# EAGLE design B165A (EAGLE 6.6.0)
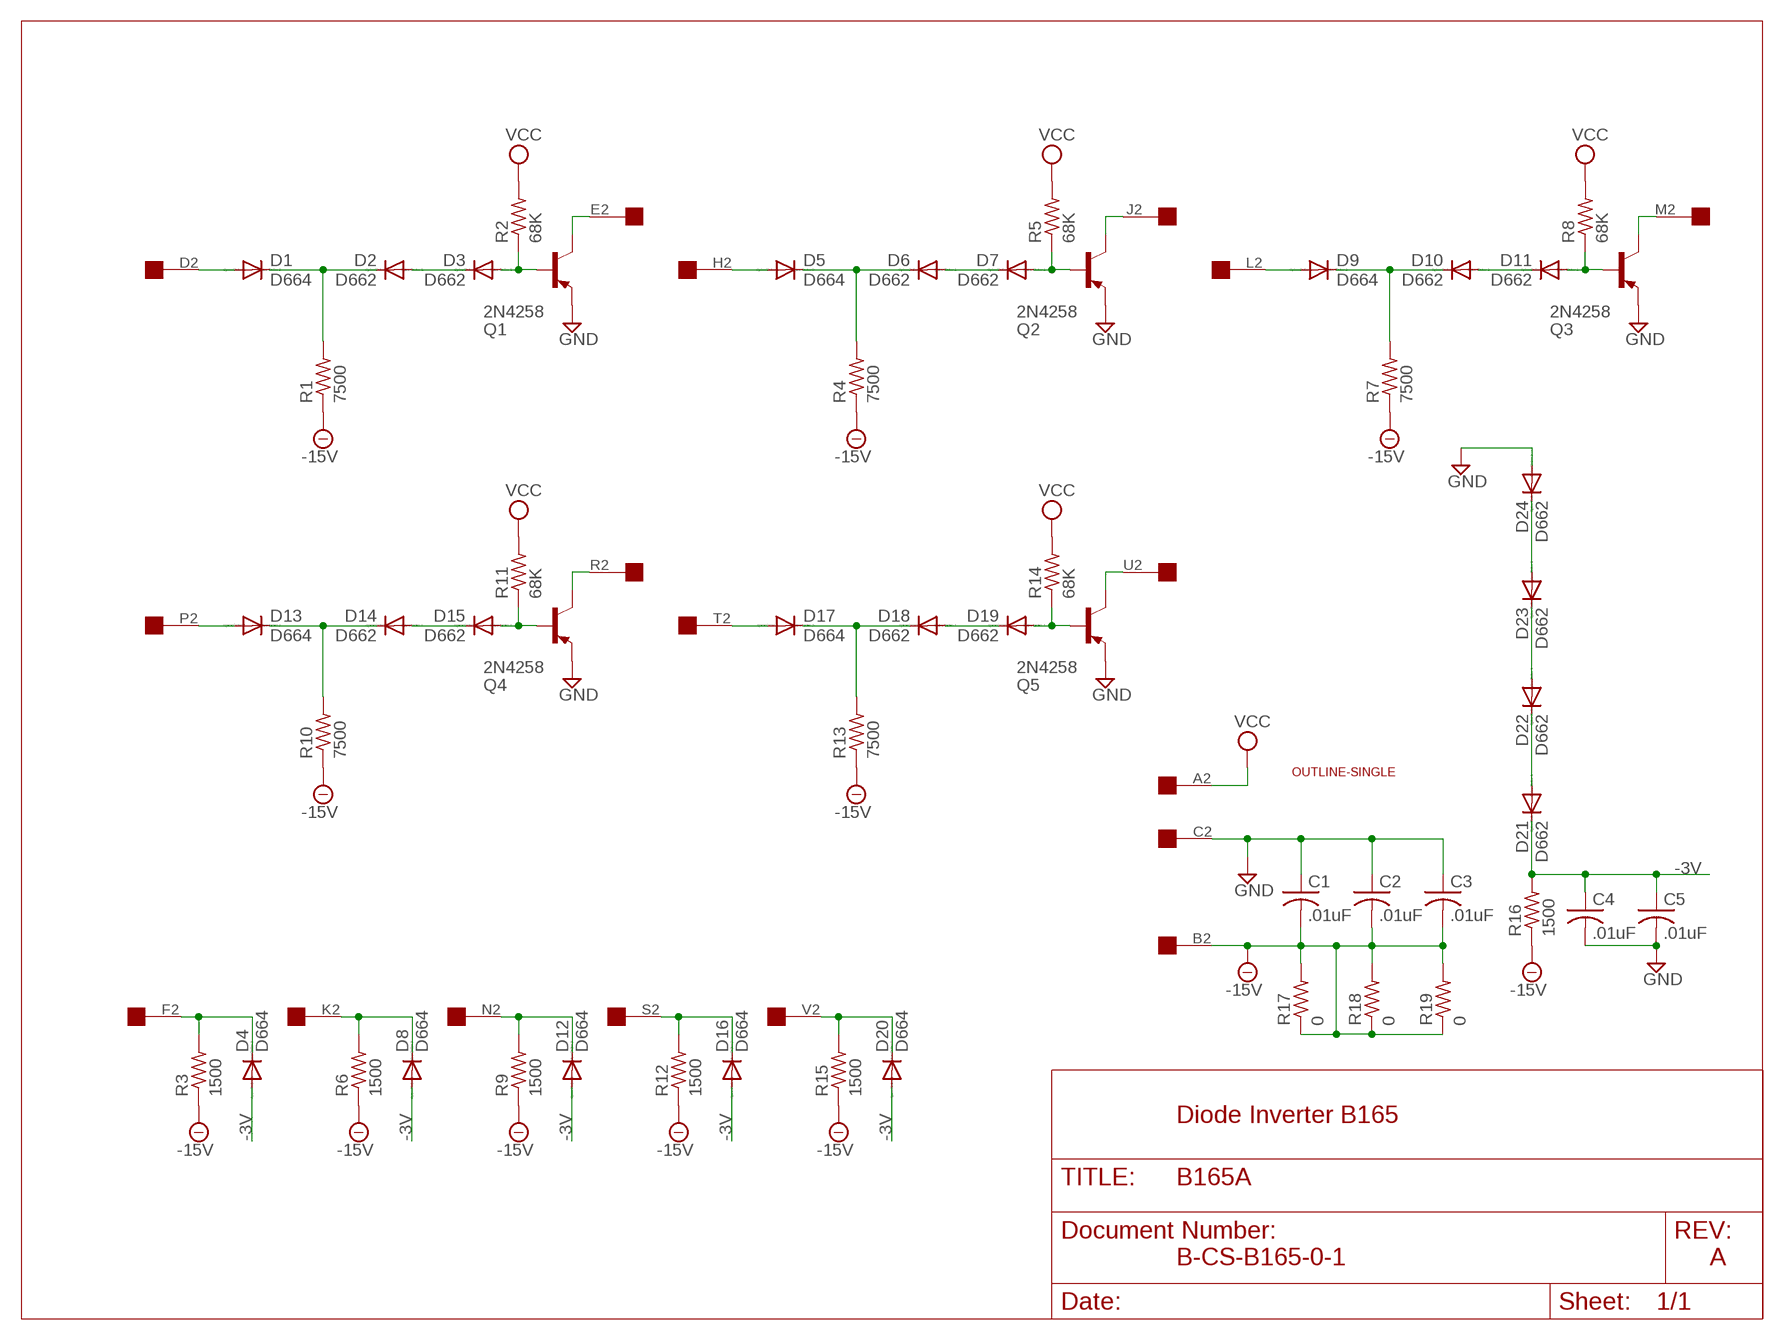
[diagram p0: schematic, sheet 1]

## Parts
C1  .01uF  C-US  [C063-025X075]
C2  .01uF  C-US  [C063-025X075]
C3  .01uF  C-US  [C063-025X075]
C4  .01uF  C-US  [C063-025X075]
C5  .01uF  C-US  [C063-025X075]
D1  D664  DIODE-DO35-10  [DO35-10]
D2  D662  DIODE-DO35-10  [DO35-10]
D3  D662  DIODE-DO35-10  [DO35-10]
D4  D664  DIODE-DO35-10  [DO35-10]
D5  D664  DIODE-DO35-10  [DO35-10]
D6  D662  DIODE-DO35-10  [DO35-10]
D7  D662  DIODE-DO35-10  [DO35-10]
D8  D664  DIODE-DO35-10  [DO35-10]
D9  D664  DIODE-DO35-10  [DO35-10]
D10  D662  DIODE-DO35-10  [DO35-10]
D11  D662  DIODE-DO35-10  [DO35-10]
D12  D664  DIODE-DO35-10  [DO35-10]
D13  D664  DIODE-DO35-10  [DO35-10]
D14  D662  DIODE-DO35-10  [DO35-10]
D15  D662  DIODE-DO35-10  [DO35-10]
D16  D664  DIODE-DO35-10  [DO35-10]
D17  D664  DIODE-DO35-10  [DO35-10]
D18  D662  DIODE-DO35-10  [DO35-10]
D19  D662  DIODE-DO35-10  [DO35-10]
D20  D664  DIODE-DO35-10  [DO35-10]
D21  D662  DIODE-DO35-10  [DO35-10]
D22  D662  DIODE-DO35-10  [DO35-10]
D23  D662  DIODE-DO35-10  [DO35-10]
D24  D662  DIODE-DO35-10  [DO35-10]
Q1  2N4258  -PNP-TO5  [TO5]
Q2  2N4258  -PNP-TO5  [TO5]
Q3  2N4258  -PNP-TO5  [TO5]
Q4  2N4258  -PNP-TO5  [TO5]
Q5  2N4258  -PNP-TO5  [TO5]
R1  7500  R-US_0207/10  [0207/10]
R2  68K  R-US_0207/10  [0207/10]
R3  1500  R-US_0207/10  [0207/10]
R4  7500  R-US_0207/10  [0207/10]
R5  68K  R-US_0207/10  [0207/10]
R6  1500  R-US_0207/10  [0207/10]
R7  7500  R-US_0207/10  [0207/10]
R8  68K  R-US_0207/10  [0207/10]
R9  1500  R-US_0207/10  [0207/10]
R10  7500  R-US_0207/10  [0207/10]
R11  68K  R-US_0207/10  [0207/10]
R12  1500  R-US_0207/10  [0207/10]
R13  7500  R-US_0207/10  [0207/10]
R14  68K  R-US_0207/10  [0207/10]
R15  1500  R-US_0207/10  [0207/10]
R16  1500  R-US_0207/10  [0207/10]
R17  0  R-US_0207/10  [0207/10]
R18  0  R-US_0207/10  [0207/10]
R19  0  R-US_0207/10  [0207/10]
U$1  OUTLINE-SINGLE  [SINGLE]
U$2  EDGE-1  [EDGE-CON1]

## Nets
-3V: C4.1 C5.1 D4.A D8.A D12.A D16.A D20.A D21.C R16.2
-15V: C1.2 C2.2 C3.2 R1.1 R3.1 R4.1 R6.1 R7.1 R9.1 R10.1 R12.1 R13.1 R15.1 R16.1 R17.1 R17.2 R18.1 R18.2 R19.1 R19.2 U$2.B2
GND: C1.1 C2.1 C3.1 C4.2 C5.2 D24.A Q1.1(E) Q2.1(E) Q3.1(E) Q4.1(E) Q5.1(E) U$2.C2
N$1: D1.A U$2.D2
N$2: D1.C D2.C R1.2
N$3: D2.A D3.C
N$4: D16.C R12.2 U$2.S2
N$5: D3.A Q1.2(B) R2.1
N$6: Q1.3(C) U$2.E2
N$7: D4.C R3.2 U$2.F2
N$8: D8.C R6.2 U$2.K2
N$9: D12.C R9.2 U$2.N2
N$10: D5.A U$2.H2
N$11: D5.C D6.C R4.2
N$12: D6.A D7.C
N$13: D17.A U$2.T2
N$14: D7.A Q2.2(B) R5.1
N$15: Q2.3(C) U$2.J2
N$16: D9.A U$2.L2
N$17: D9.C D10.C R7.2
N$18: D10.A D11.C
N$19: D17.C D18.C R13.2
N$20: D11.A Q3.2(B) R8.1
N$21: Q3.3(C) U$2.M2
N$22: D13.A U$2.P2
N$23: D13.C D14.C R10.2
N$24: D14.A D15.C
N$25: D18.A D19.C
N$26: D15.A Q4.2(B) R11.1
N$27: Q4.3(C) U$2.R2
N$28: D23.A D24.C
N$29: D22.A D23.C
N$30: D19.A Q5.2(B) R14.1
N$31: D21.A D22.C
N$32: Q5.3(C) U$2.U2
N$33: D20.C R15.2 U$2.V2
VCC: R2.2 R5.2 R8.2 R11.2 R14.2 U$2.A2

## Notes on the sheet
- Diode Inverter B165
- B-CS-B165-0-1 | A

## Library data of the parts
C1-C5 = dec-con:C-US: Capacitors with funky DEC lead spacing.
D1-D24 = diode:DIODE-: DIODE
Q1-Q5 = transistor:*-PNP-: PNP Transistror
R1-R19 = rcl:R-US_: RESISTOR, American symbol
U$1 = dec-con:OUTLINE-*: Board outlines for DEC boards.
U$2 = dec-con:EDGE-1: Single-Sided DEC Edge Connector -- (side 2)

## Net classes
0 default: width 0.813 mm

## Board
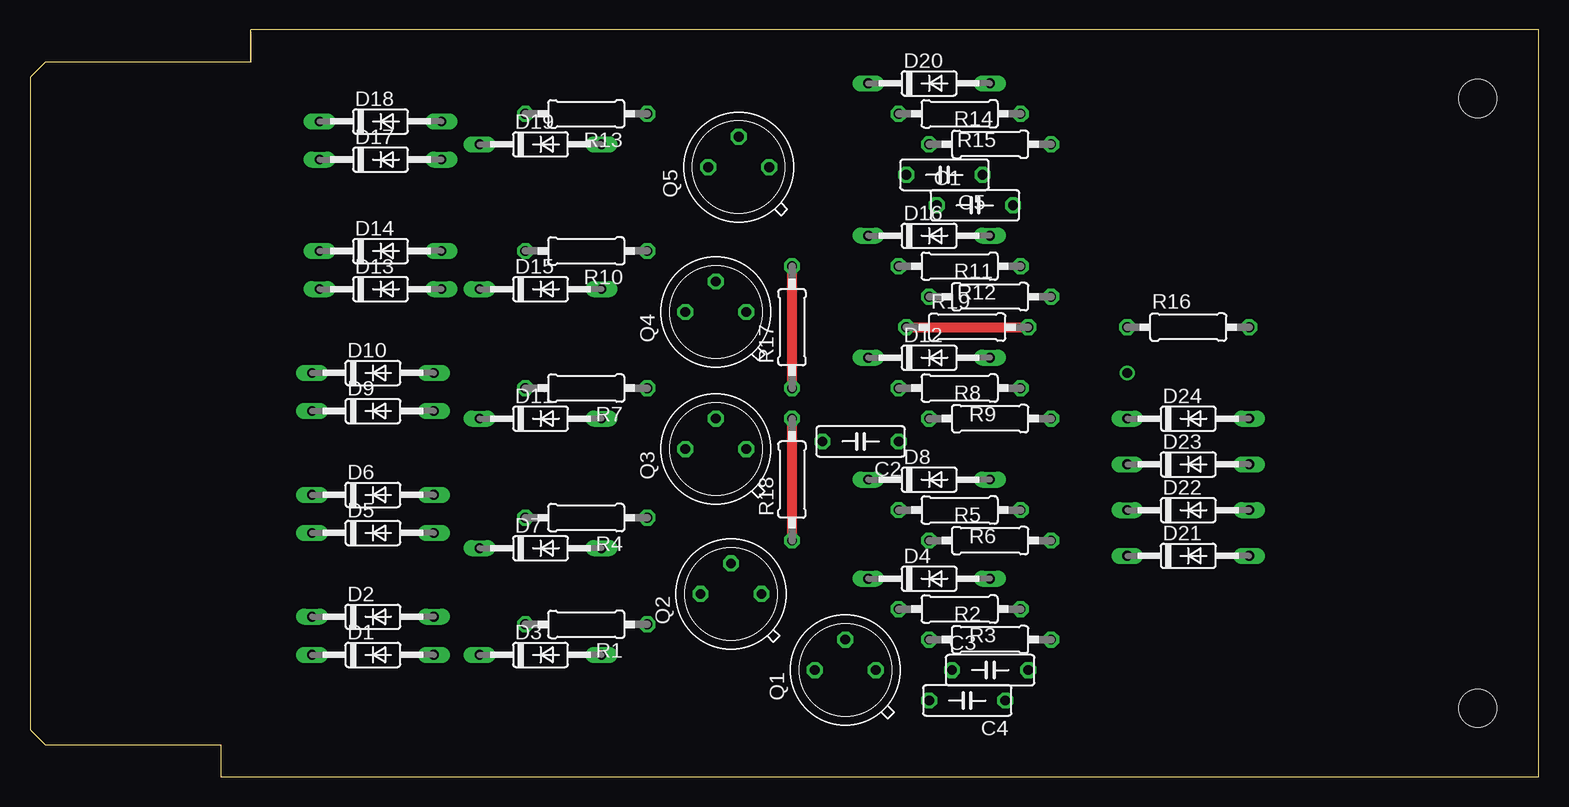
[diagram p1: board, top side]
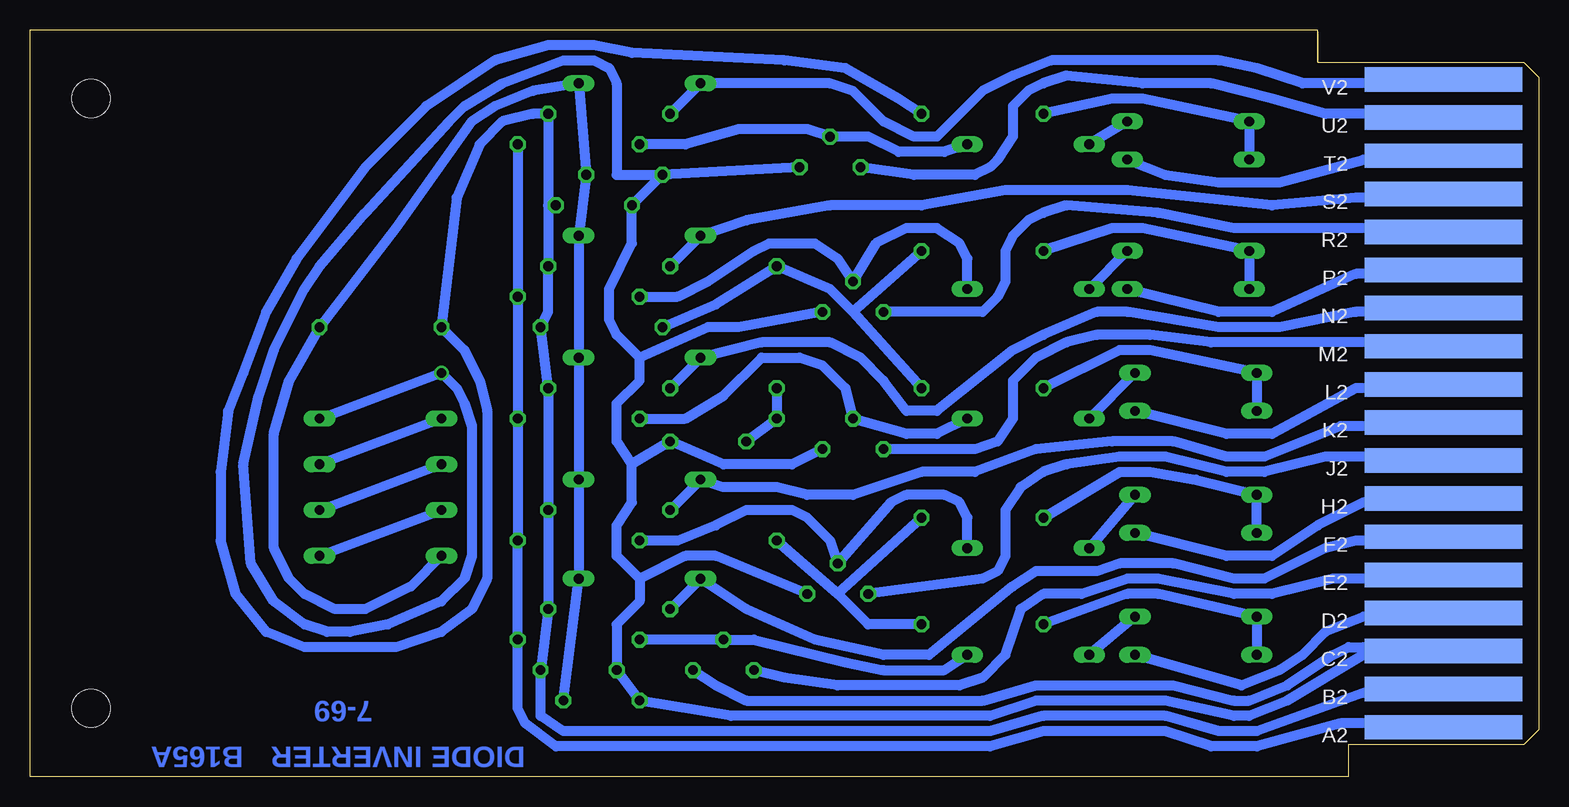
[diagram p2: board, bottom side, seen from below]

Size 125.73 x 62.23 mm. Coordinates in mm from the lower left corner, seen from the top.
Copper layers (1+16): Top 0.035mm / dielectric 1.5mm / Bottom 0.035mm
Design rules "16mils": minimum track width 16mil, minimum drill 32mil, track to track 15mil, track to pad 10mil, pad to pad 10mil, via to via 10mil, smd to smd 10mil, copper to edge 13mil, drill to drill 10mil, minimum pad ring 10mil, minimum via ring 8mil, stop-mask expansion 0mil, vias tented up to drill 0mil, thermal gap 10mil

### Footprints (pad centres in the part's own frame; a part is rotated, then mirrored left to right if it is on the bottom)
C063-025X075 = drill 0.813 octagon: 1 -2.54,0; 2 3.81,0
DO35-10 = drill 0.813 long: A 5.08,0; C -5.08,0
TO5 = drill 0.813 octagon: 1 0,-2.54; 2 2.54,0; 3 0,2.54
0207/10 = drill 0.813 octagon: 1 -5.08,0; 2 5.08,0
SINGLE = hole 3.175: 120.65,56.515; 120.65,5.715
EDGE-CON1 = smd 13.106 x 2.032 bottom: A2 7.938,4.128; B2 7.938,7.303; C2 7.938,10.477; D2 7.938,13.652; E2 7.938,16.828; F2 7.938,20.003; H2 7.938,23.177; J2 7.938,26.352; K2 7.938,29.527; L2 7.938,32.703; M2 7.938,35.877; N2 7.938,39.053; P2 7.938,42.227; R2 7.938,45.403; S2 7.938,48.578; T2 7.938,51.752; U2 7.938,54.928; V2 7.938,58.102

### Placement (x,y rotation side)
C1  78.11,47.62 0 top
C2  69.85,27.94 180 top
C3  79.38,8.89 0 top
C4  78.74,6.35 180 top
C5  76.84,50.16 180 top
D1  28.58,10.16 0 top
D2  28.58,13.34 0 top
D3  42.55,10.16 0 top
D4  74.93,16.51 0 top
D5  28.58,20.32 0 top
D6  28.58,23.5 0 top
D7  42.55,19.05 0 top
D8  74.93,24.77 0 top
D9  28.58,30.48 0 top
D10  28.58,33.66 0 top
D11  42.55,29.84 0 top
D12  74.93,34.92 0 top
D13  29.21,40.64 0 top
D14  29.21,43.81 0 top
D15  42.55,40.64 0 top
D16  74.93,45.09 0 top
D17  29.21,51.44 0 top
D18  29.21,54.61 0 top
D19  42.55,52.7 0 top
D20  74.93,57.78 0 top
D21  96.52,18.41 0 top
D22  96.52,22.23 0 top
D23  96.52,26.04 0 top
D24  96.52,29.84 0 top
Q1  67.95,8.89 90 top
Q2  58.42,15.24 90 top
Q3  57.15,27.3 90 top
Q4  57.15,38.73 90 top
Q5  59.06,50.8 90 top
R1  46.36,12.7 180 top
R2  80.01,11.43 0 top
R3  77.47,13.97 180 top
R4  46.36,21.59 180 top
R5  80.01,19.68 0 top
R6  77.47,22.23 180 top
R7  46.36,32.38 180 top
R8  80.01,29.84 0 top
R9  77.47,32.38 180 top
R10  46.36,43.81 180 top
R11  80.01,40.01 0 top
R12  77.47,42.55 180 top
R13  46.36,55.24 180 top
R14  80.01,52.7 0 top
R15  77.47,55.24 180 top
R16  96.52,37.47 0 top
R17  63.5,37.47 90 top
R18  63.5,24.77 90 top
R19  78.11,37.47 0 top
U$1  0,0 0 top
U$2  0,0 0 top

### Tracks (layer width: path | path; a pad name or v marks a point on that pad's centre or on a via)
-3V
  Bottom 0.813: D21.C 93.98,15.88 97.79,13.97 100.33,13.97 102.87,15.24 104.14,16.51 105.41,19.05 105.41,28.57 104.14,33.02 R16.2 95.25,45.72 88.9,54.61 87,55.88 83.82,57.15 D20.A C5.1 D16.A D12.A D8.A D4.A C4.1
-15V
  Top 0.813: R18.1 R18.2 | R17.1 R17.2 | R19.1 R19.2
  Bottom 0.813: U$2.B2 8.89,6.99 14.61,6.99 23.5,3.81 26.67,3.81 31.12,5.08 41.28,5.08 45.72,3.81 81.28,3.81 83.19,5.08 C3.2 R3.1 R6.1 R9.1 R19.2 82.55,38.73 R12.1 82.55,47.62 | R1.1 55.88,12.7 58.42,15.24 | 58.42,15.24 R4.1 | R13.1 53.34,56.52 57.79,59.05 62.87,59.69 75.57,60.33 78.74,60.96 82.55,60.96 87,59.69 92.71,55.88 97.79,50.8 103.51,43.18 106.05,38.73 107.95,33.66 109.22,30.48 109.86,25.4 109.86,19.68 108.59,15.24 106.05,12.06 102.87,10.79 95.25,10.79 91.44,12.06 88.9,13.97 87.63,16.51 87.63,30.48 88.27,33.02 89.54,35.56 R16.1 90.17,48.26 88.27,52.7 86.36,54.61 83.82,55.24 R15.1 82.55,47.62 | C1.2 82.55,47.62 | R17.1 R18.2 C2.2 | R18.1 58.42,15.24 | R19.1 68.58,39.37 R17.2 59.06,40.64 57.15,38.73 | R7.1 57.15,38.73 | R10.1 57.15,38.73
GND  (via drill 0.81)
  Bottom 0.813: D24.A v91.44,33.66 90.17,32.38 89.54,31.11 88.9,29.21 88.9,18.41 89.54,16.51 91.44,14.61 95.89,12.7 99.06,12.06 100.97,12.06 102.87,12.7 105.41,14.61 107.32,17.78 107.95,26.04 106.68,31.75 105.41,35.56 102.87,40.64 101.6,42.55 97.79,46.99 90.81,54.61 89.54,55.88 86.36,57.78 81.28,59.69 78.74,59.69 77.47,59.05 76.84,57.78 76.84,50.16 C5.2 | U$2.C2 8.89,10.16 14.61,10.16 | 14.61,10.16 20.96,6.35 24.13,5.08 25.4,5.08 31.12,6.35 41.91,6.35 45.72,5.08 67.31,5.08 C4.2 C3.1 76.84,12.7 74.93,14.61 74.93,16.51 | Q1.1 68.58,7.62 66.04,6.35 46.36,6.35 41.91,7.62 30.48,7.62 25.4,6.35 24.13,6.35 20.96,7.62 17.15,10.16 15.88,10.79 14.61,10.79 14.61,10.16 | Q5.1 C5.2 | C5.2 C1.1 75.57,44.45 77.47,40.64 77.47,38.1 76.84,36.83 74.93,34.92 | Q4.1 66.68,37.47 69.22,37.47 74.93,34.92 | Q3.1 62.23,26.04 67.95,26.04 C2.1 75.57,26.04 | 75.57,26.04 76.84,27.94 76.84,31.11 74.93,33.02 74.93,34.92 | Q2.1 68.58,18.41 71.12,18.41 74.93,16.51 | 74.93,16.51 76.84,18.41 76.84,20.95 75.57,22.86 75.57,26.04
N$1
  Bottom 0.813: U$2.D2 8.89,13.34 14.61,13.34 17.78,12.06 19.69,10.16 21.59,8.89 24.77,7.62 D1.A
N$2
  Bottom 0.813: D1.C D2.C 31.75,15.24 34.29,15.24 R1.2
N$3
  Bottom 0.813: D2.A D3.C
N$4
  Bottom 0.813: R12.2 D16.C 66.04,46.35 59.06,47.62 51.44,47.62 44.45,48.9 34.29,48.9 22.23,47.62 15.24,48.26 8.89,48.26 U$2.S2
N$5
  Bottom 0.813: D3.A 49.53,8.89 54.61,8.89 57.79,9.53 65.41,11.43 Q1.2 R2.1
N$6
  Bottom 0.813: U$2.E2 8.89,16.51 17.15,16.51 22.23,15.24 25.4,15.24 31.75,16.51 34.29,16.51 38.1,15.24 41.28,15.24 43.18,13.97 44.45,10.16 46.36,8.26 48.26,7.62 58.42,7.62 62.87,8.26 Q1.3
N$7
  Bottom 0.813: U$2.F2 8.89,19.68 15.24,19.68 17.78,19.05 22.86,16.51 25.4,16.51 30.48,17.78 34.93,17.78 36.83,17.14 41.91,17.14 43.82,15.88 50.8,10.16 54.61,10.16 60.33,11.43 66.04,13.97 D4.C R3.2
N$8
  Bottom 0.813: R6.2 D8.C 67.95,24.13 63.5,24.13 60.96,23.5 57.15,23.5 51.44,25.4 46.99,25.4 41.91,27.3 35.56,27.94 30.48,27.94 26.04,26.67 22.86,26.67 16.51,29.21 8.89,29.21 U$2.K2
N$9
  Bottom 0.813: R9.2 D12.C 64.77,36.2 59.06,36.2 56.52,34.92 54.61,33.02 52.71,30.48 50.17,30.48 43.82,35.56 41.28,36.83 36.83,38.73 34.29,38.73 26.67,37.47 21.59,37.47 15.24,38.73 8.26,38.73 U$2.N2
N$10
  Bottom 0.813: U$2.H2 8.89,22.86 14.61,22.86 18.42,20.95 22.23,18.41 26.04,18.41 D5.A
N$11
  Bottom 0.813: D5.C D6.C 28.58,24.77 32.39,25.4 34.93,25.4 R4.2
N$12
  Bottom 0.813: D6.A D7.C
N$13
  Bottom 0.813: D17.A 31.12,50.16 26.67,49.53 21.59,49.53 14.61,51.44 8.89,51.44 U$2.T2
N$14
  Bottom 0.813: D7.A 47.63,21.59 48.26,22.86 49.53,23.5 52.71,23.5 53.98,22.86 Q2.2 59.06,19.68 60.96,21.59 62.23,22.23 66.04,22.23 68.58,20.95 71.76,19.68 R5.1
N$15
  Bottom 0.813: U$2.J2 8.26,26.67 17.78,26.67 22.86,25.4 26.04,25.4 31.12,26.67 34.93,26.67 39.37,26.04 41.28,25.4 43.18,24.13 44.45,22.23 44.45,18.41 45.09,17.14 46.36,16.51 Q2.3
N$16
  Bottom 0.813: U$2.L2 8.89,32.38 15.24,32.38 22.23,28.57 26.04,28.57 D9.A
N$17
  Bottom 0.813: D9.C D10.C 32.39,35.56 34.93,35.56 R7.2
N$18
  Bottom 0.813: D10.A D11.C
N$19
  Bottom 0.813: D17.C D18.C 33.02,56.52 35.56,56.52 R13.2
N$20
  Bottom 0.813: D11.A 50.17,28.57 52.71,28.57 Q3.2 57.79,32.38 59.69,34.29 61.6,34.92 64.77,34.92 67.95,31.75 71.12,29.84 R8.1
N$21
  Bottom 0.813: U$2.M2 8.89,36.2 27.31,36.2 32.39,36.83 36.83,36.83 39.37,36.2 41.91,34.92 43.82,33.02 43.82,29.84 45.09,27.94 46.99,27.3 Q3.3
N$22
  Bottom 0.813: U$2.P2 9.53,41.91 15.24,41.91 22.23,38.73 26.67,38.73 D13.A
N$23
  Bottom 0.813: D13.C D14.C 33.02,45.72 35.56,45.72 R10.2
N$24
  Bottom 0.813: D14.A D15.C
N$25
  Bottom 0.813: D18.A D19.C
N$26
  Bottom 0.813: D15.A 47.63,43.18 48.26,44.45 50.17,45.72 52.71,45.72 55.25,44.45 Q4.2 58.42,43.18 60.33,44.45 64.14,44.45 65.41,43.81 69.22,41.27 71.76,40.01 R11.1
N$27
  Bottom 0.813: U$2.R2 8.89,45.72 25.4,45.72 31.75,46.99 39.37,47.62 41.28,46.99 42.55,46.35 43.82,45.09 44.45,43.81 44.45,41.27 45.09,40.01 46.36,38.73 Q4.3
N$28
  Bottom 0.813: D24.C D23.A
N$29
  Bottom 0.813: D22.A D23.C
N$30
  Bottom 0.813: R14.1 71.12,52.7 66.68,53.98 60.96,53.98 Q5.2 55.88,53.34 53.34,52.07 49.53,52.07 D19.A
N$31
  Bottom 0.813: D21.A D22.C
N$32
  Bottom 0.813: U$2.U2 9.53,55.24 17.78,55.24 22.23,56.52 27.31,57.78 33.02,57.78 39.37,58.42 41.28,57.78 42.55,57.15 43.82,55.88 43.82,53.34 45.09,51.44 45.72,50.8 46.99,50.16 52.07,50.16 Q5.3
N$33
  Bottom 0.813: U$2.V2 8.89,57.78 19.69,57.78 23.5,59.05 26.67,59.69 40.64,59.69 43.82,58.42 46.36,57.15 50.17,53.34 52.07,53.34 54.61,54.61 57.15,57.15 59.06,57.78 D20.C R15.2
VCC
  Bottom 0.813: U$2.A2 8.89,4.45 16.51,4.45 23.5,2.54 27.31,2.54 31.12,3.81 41.28,3.81 45.72,2.54 81.92,2.54 84.46,4.45 85.09,5.71 R2.2 R5.2 R8.2 R11.2 R14.2

### Text on the board
Bottom: 7-69 | DIODE INVERTER | B165A